# EAGLE design 616_spo2 (EAGLE 9.6.2)

## Sheet 1 of 2
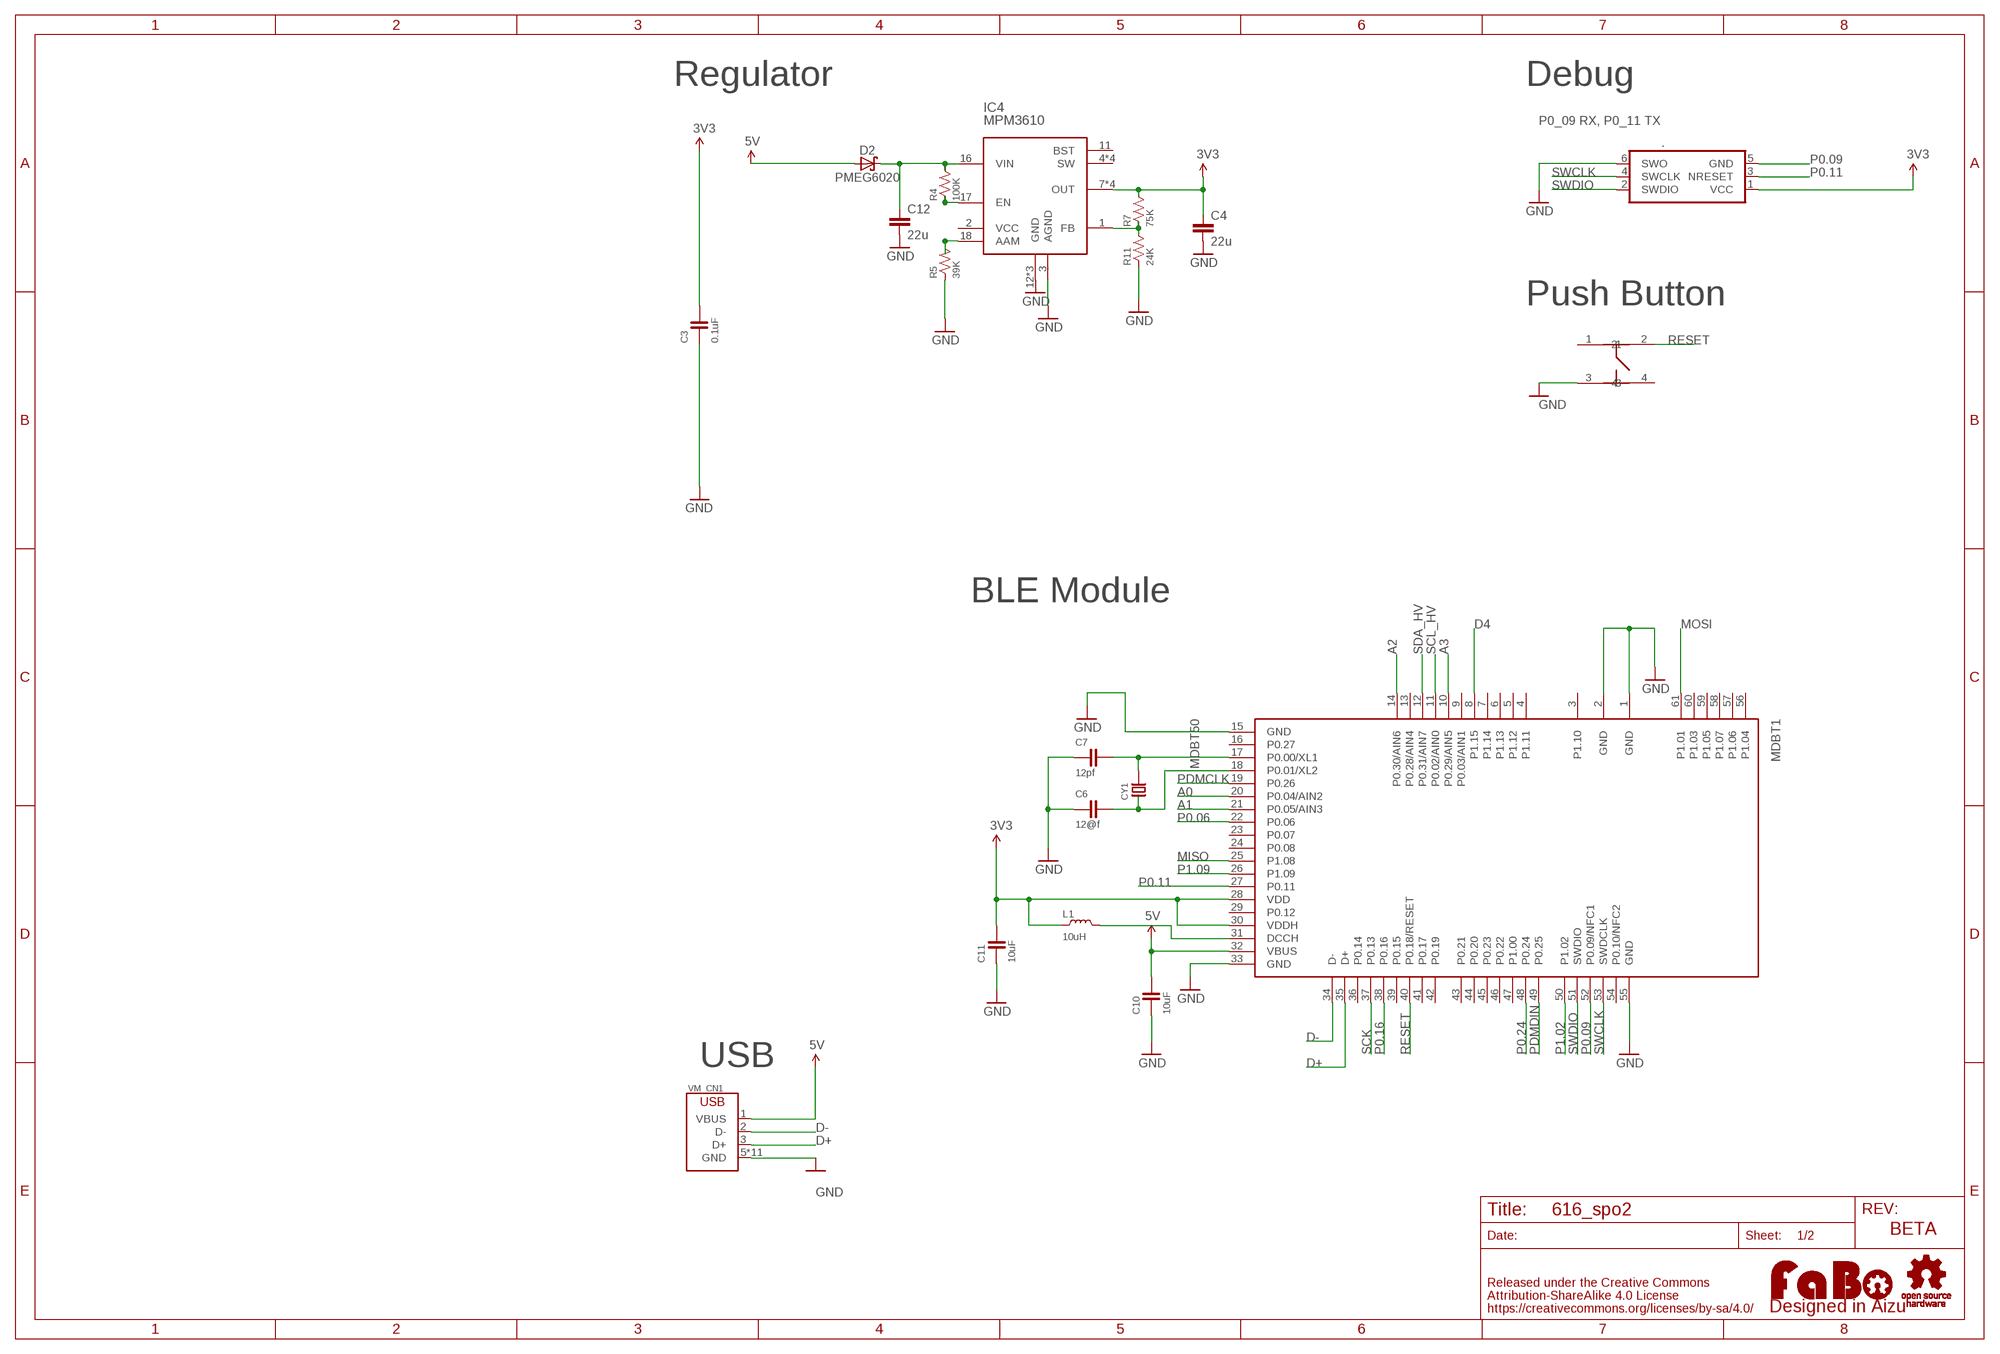
[diagram p0: schematic, sheet 1]

### Parts
.  TC2030-IDC-NL  [TC2030-IDC-NL]
C3  0.1uF  CAPACITOR-0603  [0603]
C4  22u  C-22U-0805  [0805-R2013X50N]
C6  12@f  CAPACITOR-0603  [0603]
C7  12pf  CAPACITOR-0603  [0603]
C10  10uF  CAPACITOR-0603  [0603]
C11  10uF  CAPACITOR-0603  [0603]
C12  22u  C-22U-0805  [0805-R2013X50N]
CY1  CRYSTAL-ABS07  [ABRACON-ABS07-32.768KHZ]
D2  PMEG6020  PMEG6020AELRX  [SODFL3517X110N]
IC4  MPM3610  [MPM3610]
L1  10uH  COIL-0603  [0603]
LOGO1  LOGO_FABO-M  [LOGO_FABO_M]
MDBT1  MDBT50  [MDBT50]
R4  100K  RESISTOR-0603  [0603]
R5  39K  RESISTOR-0603  [0603]
R7  75K  RESISTOR-0603  [0603]
R11  24K  RESISTOR-0603  [0603]
U$2  LOGO_OSHW-M_BOTTOM  [LOGO_OSHW_M_BOTTOM]
U$5  SWICTH-4P(KMR2)  [SWITCH-4P(KMR2)]
VM_CN1  USB-ZX62D  [ZX62D-B-5PA8]

### Nets
3V3: ..1(VCC) C3.2 C4.1 C11.2 IC4.7(OUT) IC4.8(OUT) IC4.9(OUT) IC4.20(OUT) L1.1 MDBT1.28(VDD) MDBT1.30(VDDH) R7.2
5V: C10.2 D2.A MDBT1.32(VBUS) VM_CN1.1(VBUS) ; also sheet 2
A0: MDBT1.20(P0.04/AIN2)
A1: MDBT1.21(P0.05/AIN3)
A2: MDBT1.14(P0.30/AIN6)
A3: MDBT1.10(P0.29/AIN5)
D4: MDBT1.8(P1.15)
D+: MDBT1.35(D+) VM_CN1.3(D+)
D-: MDBT1.34(D-) VM_CN1.2(D-)
FB: IC4.1(FB) R7.1 R11.2
GND: ..6(SWO) C3.1 C4.2 C6.1 C7.1 C10.1 C11.1 C12.2 IC4.3(AGND) IC4.12(GND) IC4.13(GND) IC4.14(GND) MDBT1.1(GND) MDBT1.2(GND) MDBT1.15(GND) MDBT1.33(GND) MDBT1.55(GND) R5.1 R11.1 U$5.3 VM_CN1.5(GND) VM_CN1.B1(GND) VM_CN1.B2(GND) VM_CN1.B3(GND) VM_CN1.B4(GND) VM_CN1.T1(GND) VM_CN1.T2(GND) VM_CN1.T3(GND) VM_CN1.T4(GND) VM_CN1.T5(GND) VM_CN1.T6(GND) ; also sheet 2
MISO: MDBT1.25(P1.08)
MOSI: MDBT1.61(P1.01)
N$4: IC4.17(EN) R4.1
N$5: C12.1 D2.C IC4.16(VIN) R4.2
N$6: IC4.18(AAM) R5.2
N$20: C7.2 CY1.P$2 MDBT1.17(P0.00/XL1)
N$21: C6.2 CY1.P$1 MDBT1.18(P0.01/XL2)
N$22: L1.2 MDBT1.31(DCCH)
P0.06: MDBT1.22(P0.06)
P0.09: ..5(GND) MDBT1.52(P0.09/NFC1)
P0.11: ..3(NRESET) MDBT1.27(P0.11)
P0.16: MDBT1.38(P0.16)
P0.24: MDBT1.48(P0.24)
P1.02: MDBT1.50(P1.02)
P1.09: MDBT1.26(P1.09)
PDMCLK: MDBT1.19(P0.26)
PDMDIN: MDBT1.49(P0.25)
RESET: MDBT1.40(P0.18/RESET) U$5.2
SCK: MDBT1.37(P0.13)
SCL_HV: MDBT1.11(P0.02/AIN0) ; also sheet 2
SDA_HV: MDBT1.12(P0.31/AIN7) ; also sheet 2
SWCLK: ..4(SWCLK) MDBT1.53(SWDCLK)
SWDIO: ..2(SWDIO) MDBT1.51(SWDIO)
Unconnected: IC4.2(VCC) IC4.4(SW) IC4.5(SW) IC4.6(SW) IC4.11(BST) IC4.19(SW) MDBT1.3(P1.10) MDBT1.4(P1.11) MDBT1.5(P1.12) MDBT1.6(P1.13) MDBT1.7(P1.14) MDBT1.9(P0.03/AIN1) MDBT1.13(P0.28/AIN4) MDBT1.16(P0.27) MDBT1.23(P0.07) MDBT1.24(P0.08) MDBT1.29(P0.12) MDBT1.36(P0.14) MDBT1.39(P0.15) MDBT1.41(P0.17) MDBT1.42(P0.19) MDBT1.43(P0.21) MDBT1.44(P0.20) MDBT1.45(P0.23) MDBT1.46(P0.22) MDBT1.47(P1.00) MDBT1.54(P0.10/NFC2) MDBT1.56(P1.04) MDBT1.57(P1.06) MDBT1.58(P1.07) MDBT1.59(P1.05) MDBT1.60(P1.03) U$5.1 U$5.4

### Notes on the sheet
- Regulator | Debug
- P0_09 RX, P0_11 TX
- Push Button
- BLE Module
- USB
- BETA

## Sheet 2 of 2
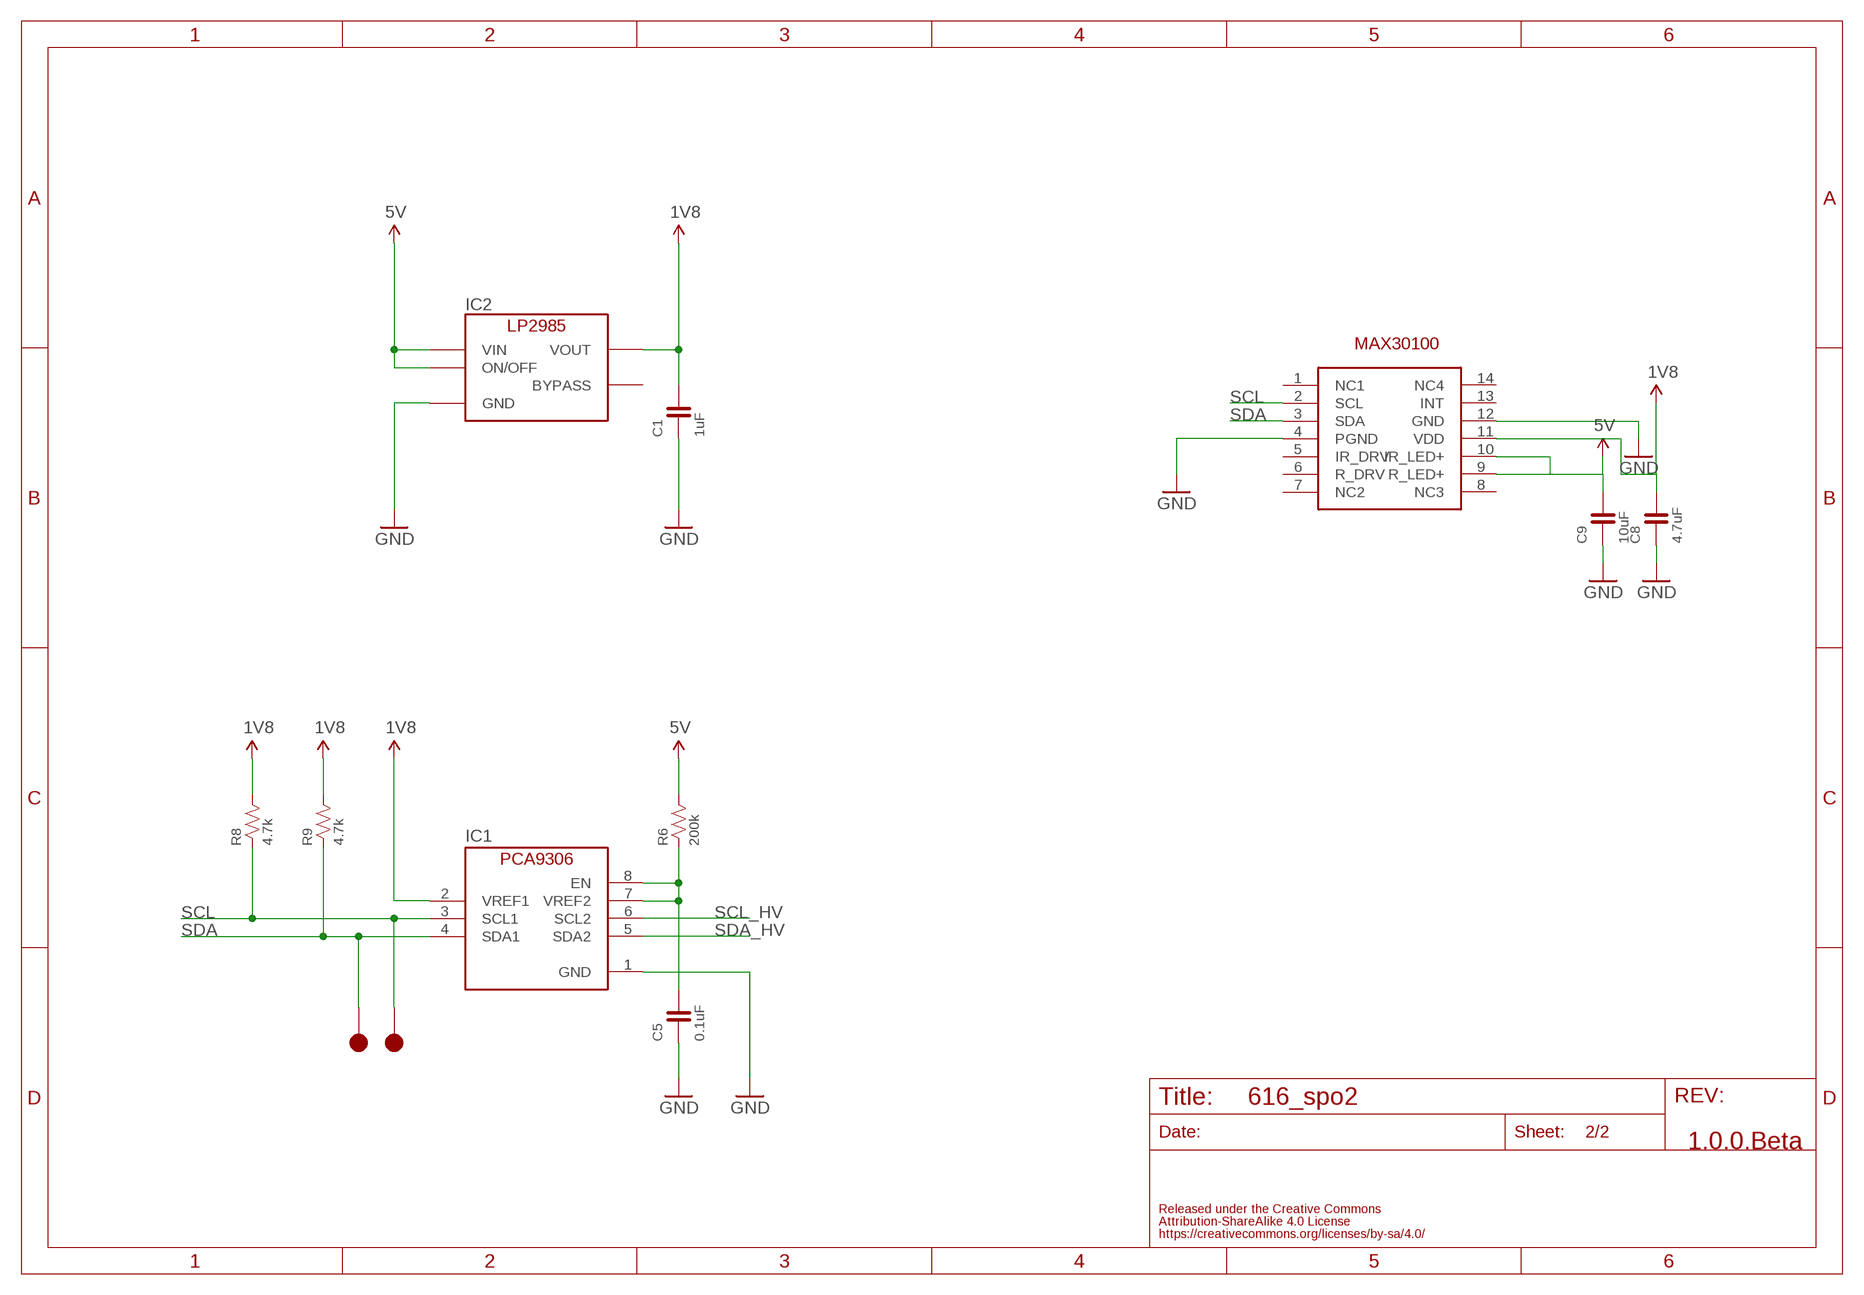
[diagram p1: schematic, sheet 2]

### Parts
C1  1uF  CAPACITOR-0603  [0603]
C5  0.1uF  CAPACITOR-0603  [0603]
C8  4.7uF  CAPACITOR-0603  [0603]
C9  10uF  CAPACITOR-0603  [0603]
IC1  PCA9306GM  [XQFN8]
IC2  LP2985-33DBV  [SOT-23-5]
MAX30100  MA-MAX30100  [MAXIM-30100]
R6  200k  RESISTOR-0603  [0603]
R8  4.7k  RESISTOR-0603  [0603]
R9  4.7k  RESISTOR-0603  [0603]
TP1  TP-15  [TP-15]
TP2  TP-15  [TP-15]

### Nets
1V8: C1.2 C8.2 IC1.2(VREF1) IC2.5(VOUT) MAX30100.11(VDD) R8.2 R9.2
5V: C9.2 IC2.1(VIN) IC2.3(ON/OFF) MAX30100.9(R_LED+) MAX30100.10(IR_LED+) R6.2 ; also sheet 1
GND: C1.1 C5.1 C8.1 C9.1 IC1.1(GND) IC2.2(GND) MAX30100.4(PGND) MAX30100.12(GND) ; also sheet 1
N$15: C5.2 IC1.7(VREF2) IC1.8(EN) R6.1
SCL: IC1.3(SCL1) MAX30100.2(SCL) R8.1 TP2.1
SCL_HV: IC1.6(SCL2) ; also sheet 1
SDA: IC1.4(SDA1) MAX30100.3(SDA) R9.1 TP1.1
SDA_HV: IC1.5(SDA2) ; also sheet 1
Unconnected: IC2.4(BYPASS) MAX30100.1(NC1) MAX30100.5(IR_DRV) MAX30100.6(R_DRV) MAX30100.7(NC2) MAX30100.8(NC3) MAX30100.13(INT) MAX30100.14(NC4)

### Notes on the sheet
- 1.0.0.Beta

## Library data of the parts
. = TagConnect:TC2030-IDC: Tag-Connect In Circuit Programming & Debug Cable 6 Pin http://www.tag-connect.com
C1 C3 C5-C11 = FaBo-Capacitor:CAPACITOR: CAPACITOR
C4 C12 = Arduino-rcl:C: SMD Capacitor; CODE-ARDUINO: 2233; DATASHEET: https://media.digikey.com/pdf/Data%20Sheets/Samsung%20PDFs/CL21A226MQCLQNC_character.pdf; DISTRIBUTOR-LINK: https://www.digikey.com/product-detail/en/samsung-electro-mechanics-america-inc/CL21A226MQCLQNC/1276-2412-1-ND/3890498; DISTRIBUTOR-PN: 1276-2412-1-ND; MANUFACTURER: Samsung; MANUFACTURER-PN: CL21A226MQCLQNC; NOTE: -
CY1 = FaBo-Crystal:CRYSTAL
D2 = Arduino-diodes:PMEG6020AELRX: 60 V, 2 A low leakage current Schottky barrier rectifier Datasheet <http://www.nxp.com/documents/data_sheet/PMEG6020AELR.pdf>; CODE-ARDUINO: 2208; DATASHEET: http://www.nxp.com/documents/data_sheet/PMEG6020AELR.pdf; DISTRIBUTOR-LINK: http://www.digikey.com/products/en?keywords=%20568-12710-1-ND; DISTRIBUTOR-PN: 568-12710-1-ND; MANUFACTURER: NXP; MANUFACTURER-PN: PMEG6020AELRX
IC1 = FaBo-LevelTranslator:PCA9306
IC2 = FaBo-Supply:LP2985: LP2985
IC4 = Arduino-ICs:MPM3610: MPM3610 Step Down Regulator; CODE-ARDUINO: 2093; DATASHEET: https://www.monolithicpower.com/pub/media/document/MPM3610_r1.01.pdf; DISTRIBUTOR-LINK: https://www.digikey.com/product-detail/en/monolithic-power-systems-inc/MPM3610AGQV-P/1589-1249-1-ND/5298336; DISTRIBUTOR-PN: 1589-1249-1-ND; MANUFACTURER: MPS; MANUFACTURER-PN: MPM3610AGQV-P; RESTRICTIONS: NO
L1 = FaBo-Coil:COIL: RESISTOR
LOGO1 = component:LOGO_FABO
MAX30100 = FaBo-Mems:MA-MAX30100
MDBT1 = MDBT50Q_171031:MDBT50: Raytac Corporation MDBT50 Bluetooth Low Energy Module based on Noridc nRF52840 Source: Raytac datasheet
R4-R9 R11 = FaBo-Resistors:RESISTOR: RESISTOR
TP1 TP2 = FaBo-Supply:TP
U$2 = FaBo-Logo:LOGO_OSHW
U$5 = gclue-test:SWICTH-4P(KMR2)
VM_CN1 = component:USB

## Net classes
2 gnd: width 0.254 mm, drill 0.61 mm, clearance 0.254 mm
3 usbvcc: width 0.254 mm, drill 0.61 mm, clearance 0.254 mm
4 aref: width 0.254 mm, drill 0.61 mm, clearance 0.254 mm

## Board
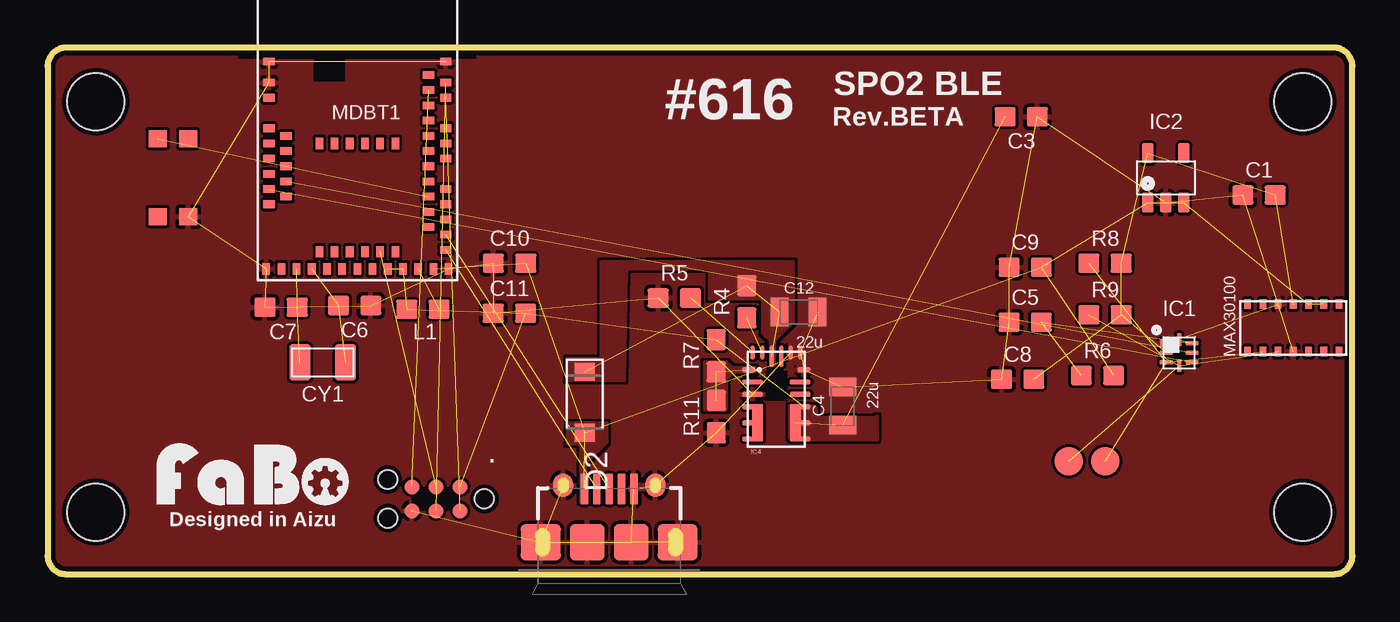
[diagram p2: board, top side]
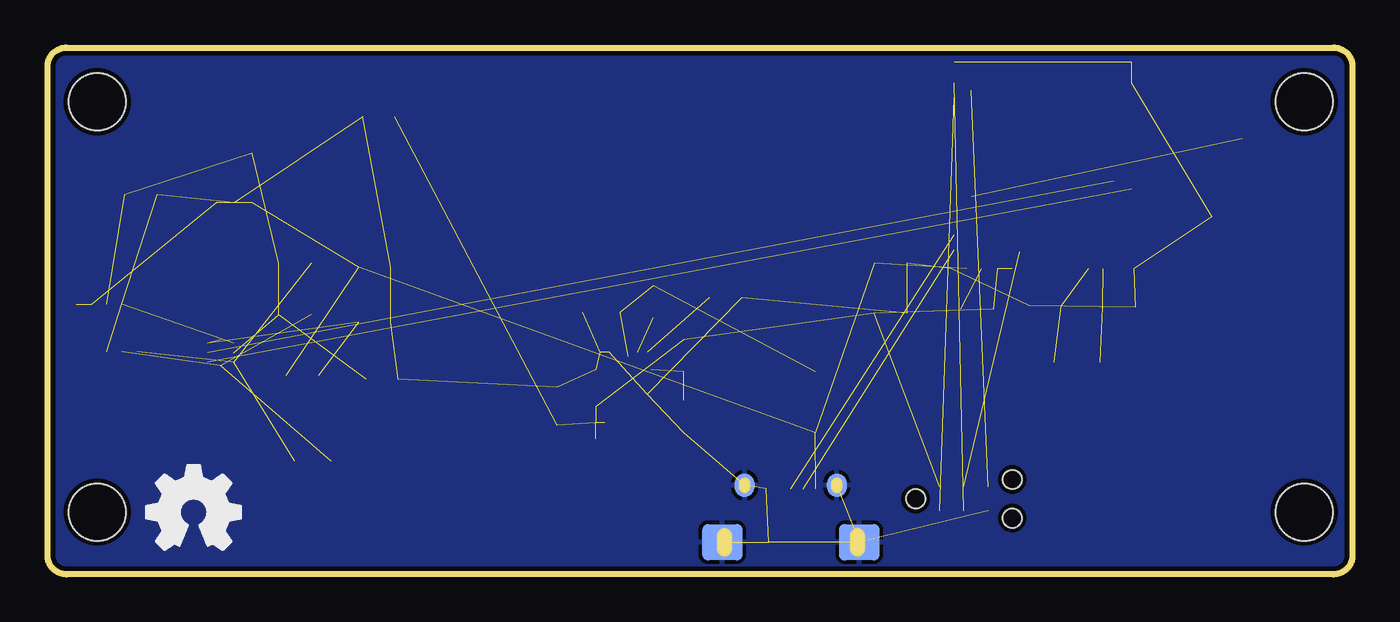
[diagram p3: board, bottom side, seen from below]

Size 68.66 x 27.71 mm. Coordinates in mm from the lower left corner, seen from the top.
Outline: 1,0 67.66,0 arc90 68.66,1 68.66,26.71 arc90 67.66,27.71 1,27.71 arc90 0,26.71 0,1 arc90 1,0
Copper layers (1*16): Top 0.035mm / dielectric 1.6mm / Bottom 0.035mm
Design rules "PCBway": minimum track width 6mil, minimum drill 12mil, track to track 6mil, track to pad 6mil, pad to pad 6mil, via to via 6mil, smd to smd 6mil, copper to edge 10mil, drill to drill 10mil, minimum pad ring 10mil, minimum via ring 6mil, stop-mask expansion 2mil, vias tented up to drill 100mil, thermal gap 8mil
Holes 3 mm at 2.54,24.86 2.54,3.27 66.04,3.27 66.04,24.86

### Footprints (pad centres in the part's own frame; a part is rotated, then mirrored left to right if it is on the bottom)
TC2030-IDC-NL = smd 0.787 x 0.787: 1 -1.27,-0.635; 2 -1.27,0.635; 3 0,-0.635; 4 0,0.635; 5 1.27,-0.635; 6 1.27,0.635 | hole 0.991: -2.54,0; 2.54,1.016; 2.54,-1.016
0603 = smd 1.1 x 1: 1 -0.85,0; 2 0.85,0
0805-R2013X50N = smd 0.95 x 1.45: 1 -1,0; 2 1,0
ABRACON-ABS07-32.768KHZ = smd 1.1 x 1.9: P$1 -1.2,0; P$2 1.2,0
SODFL3517X110N = smd 0.91 x 1.07: A 1.605,0; C -1.605,0
XQFN8 = smd 0.7 x 0.35: 1 -0.675,0.5 | smd 0.7 x 0.25: 2 -0.675,0; 3 -0.675,-0.5; 5 0.675,-0.5; 6 0.675,0; 7 0.675,0.5 | smd 0.25 x 0.7: 4 0,-0.675; 8 0,0.675
SOT-23-5 = smd 0.6 x 1.05: 1 -0.95,-1.3; 2 0,-1.3; 3 0.95,-1.3; 4 0.95,1.3; 5 -0.95,1.3
MPM3610 = smd 0.7 x 0.25: 1 -1.45,1.55; 4 -1.45,-0.4; 5 -1.45,-1.25; 6 -1.45,-2.1; 7 1.45,-2.1; 8 1.45,-1.25; 9 1.45,-0.4; 12 1.45,1.55 | smd 1.1 x 0.25: 2 -1.25,0.9; 3 -1.25,0.25; 10 1.25,0.25; 11 1.25,0.9 | smd 0.25 x 0.7: 13 1.25,2.45; 14 0.75,2.45; 17 -0.75,2.45; 18 -1.25,2.45 | smd 0.25 x 1.1: 15 0.25,2.25; 16 -0.25,2.25 | smd 0.6 x 1.95: 19 -1,-1.25; 20 1,-1.25
MAXIM-30100 = smd 0.5 x 0.35: 1 -1.25,2.4; 2 -1.25,1.6; 3 -1.25,0.8; 4 -1.25,0; 5 -1.25,-0.8; 6 -1.25,-1.6; 7 -1.25,-2.4; 8 1.25,-2.4; 9 1.25,-1.6; 10 1.25,-0.8; 11 1.25,0; 12 1.25,0.8; 13 1.25,1.6; 14 1.25,2.4
MDBT50 = smd 0.6 x 0.4: 1 -4.65,3.75; 2 -4.65,2.65; 3 -4.65,1.85; 4 -4.65,0.25; 5 -3.75,-0.15; 6 -4.65,-0.55; 7 -3.75,-0.95; 8 -4.65,-1.35; 9 -3.75,-1.75; 10 -4.65,-2.15; 11 -3.75,-2.55; 12 -4.65,-2.95; 13 -3.75,-3.35; 14 -4.65,-3.75; 34 4.65,-6.15; 35 4.65,-5.35; 36 3.75,-4.95; 37 4.65,-4.55; 38 3.75,-4.15; 39 4.65,-3.75; 40 3.75,-3.35; 41 4.65,-2.95; 42 3.75,-2.55; 43 3.75,-1.75; 44 4.65,-1.35; 45 3.75,-0.95; 46 4.65,-0.55; 47 3.75,-0.15; 48 4.65,0.25; 49 3.75,0.65; 50 3.75,1.45; 51 4.65,1.85; 52 3.75,2.25; 53 4.65,2.65; 54 3.75,3.05; 55 4.65,3.75 | smd 0.4 x 0.6: 15 -4.8,-7.15; 16 -4,-7.15; 17 -3.2,-7.15; 18 -2.4,-7.15; 19 -2,-6.25; 20 -1.6,-7.15; 21 -1.2,-6.25; 22 -0.8,-7.15; 23 -0.4,-6.25; 24 0,-7.15; 25 0.4,-6.25; 26 0.8,-7.15; 27 1.2,-6.25; 28 1.6,-7.15; 29 2,-6.25; 30 2.4,-7.15; 31 3.2,-7.15; 32 4,-7.15; 33 4.8,-7.15; 56 -2,-0.55; 57 -1.2,-0.55; 58 -0.4,-0.55; 59 0.4,-0.55; 60 1.2,-0.55; 61 2,-0.55
TP-15 = smd 1.5 x 1.5: 1 0,0
SWITCH-4P(KMR2) = smd 0.9 x 0.95: 1 -1,0; 2 3.1,0; 3 -1,-1.6; 4 3.1,-1.6
ZX62D-B-5PA8 = smd 0.4 x 1.6: 1 -1.3,4.25; 2 -0.65,4.25; 3 0,4.25; 4 0.65,4.25; 5 1.3,4.25 | smd 1.05 x 1.25 bottom: B1 -2.425,4.45; B2 2.425,4.45 | smd 2.1 x 1.9 bottom: B3 -3.6,1.45; B4 3.6,1.45 | smd 1.05 x 1.25: T1 -2.425,4.45; T2 2.425,4.45 | smd 2.1 x 1.9: T3 -3.6,1.45; T6 3.6,1.45 | smd 1.8 x 1.9: T4 -1.15,1.45; T5 1.15,1.45

### Placement (x,y rotation side)
.  20.44,3.97 180 top
C1  63.74,19.96 0 top
C3  51.23,24.07 180 top
C4  41.83,8.85 90 top
C5  51.44,13.26 0 top
C6  16.16,14.14 180 top
C7  12.29,14.05 0 top
C8  51.04,10.26 0 top
C9  51.44,16.16 0 top
C10  24.31,16.37 0 top
C11  24.3,13.73 0 top
C12  39.52,13.8 0 top
CY1  14.48,11.15 180 top
D2  28.27,9.05 270 top
IC1  59.54,11.66 0 top
IC2  58.84,20.86 0 top
IC4  38.35,9.22 0 top
L1  19.75,13.95 0 top
LOGO1  10.8,3.27 0 top
MAX30100  65.54,12.96 90 top
MDBT1  16.3,23.22 0 top
R4  36.79,14.34 90 top
R5  32.98,14.54 0 top
R6  55.24,10.46 0 top
R7  35.18,11.5 90 top
R8  55.64,16.36 0 top
R9  55.64,13.66 0 top
R11  35.19,8.3 90 top
TP1  53.74,5.96 0 top
TP2  55.64,5.96 0 top
U$2  60.96,3.27 0 top
U$5  5.8,19.82 90 top
VM_CN1  29.55,0.24 0 top

### Tracks (layer width: path | path; a pad name or v marks a point on that pad's centre or on a via)
1V8  (6 unrouted)
3V3  (11 unrouted)
  pour Top (no thermals): 39.04,8.86 40.34,8.86 40.44,8.76 40.44,8.26 43.54,8.26 43.64,8.36 43.64,7.06 39.14,7.06 39.04,7.16
5V  (9 unrouted)
  pour Top (no thermals): 28.34,5.86 29.44,6.96 29.44,7.96 27.34,7.96 27.34,6.86 28.04,6.86 28.04,3.76 28.34,4.66
D+  (1 unrouted)
D-  (1 unrouted)
FB  (2 unrouted)
  pour Top (no thermals): 37.24,10.86 36.04,10.86 35.74,11.16 34.54,11.16 34.54,8.66 35.74,8.66 35.74,10.26 36.14,10.66 37.24,10.66
GND  (38 unrouted)
  pour Top (no thermals): 39.04,11.26 39.44,11.26 39.44,10.66 40.54,10.66 40.84,10.36 40.84,9.26 42.94,9.26 42.94,15.06 42.64,15.06 39.84,15.16 39.84,12.26 39.04,12.26
  pour Top (rank 2): -0.4,-0.54 68.58,-0.54 68.58,28.67 -0.4,28.67
  pour Bottom (rank 2): -0.5,-0.54 68.58,-0.54 68.58,28.67 -0.5,28.67
N$4  (1 unrouted)
N$5  (3 unrouted)
  pour Top (no thermals): 27.34,10.17 27.34,11.36 29.04,11.36 29.14,11.46 29.14,16.46 39.24,16.46 39.24,13.26 38.24,12.26 38.24,10.96 38.04,10.96 38.04,12.26 37.64,12.66 37.64,14.46 34.84,14.46 34.84,16.06 30.44,16.06 30.34,10.16
N$6  (1 unrouted)
N$15  (3 unrouted)
N$20  (2 unrouted)
N$21  (2 unrouted)
N$22  (1 unrouted)
P0.09  (1 unrouted)
P0.11  (1 unrouted)
RESET  (1 unrouted)
SCL  (3 unrouted)
SCL_HV  (1 unrouted)
SDA  (3 unrouted)
SDA_HV  (1 unrouted)
SWCLK  (1 unrouted)
SWDIO  (1 unrouted)

### Text on the board
tPlace: SPO2 BLE | #616 | Rev.BETA | Designed in Aizu